# EAGLE design micro_solar (EAGLE 5.07)
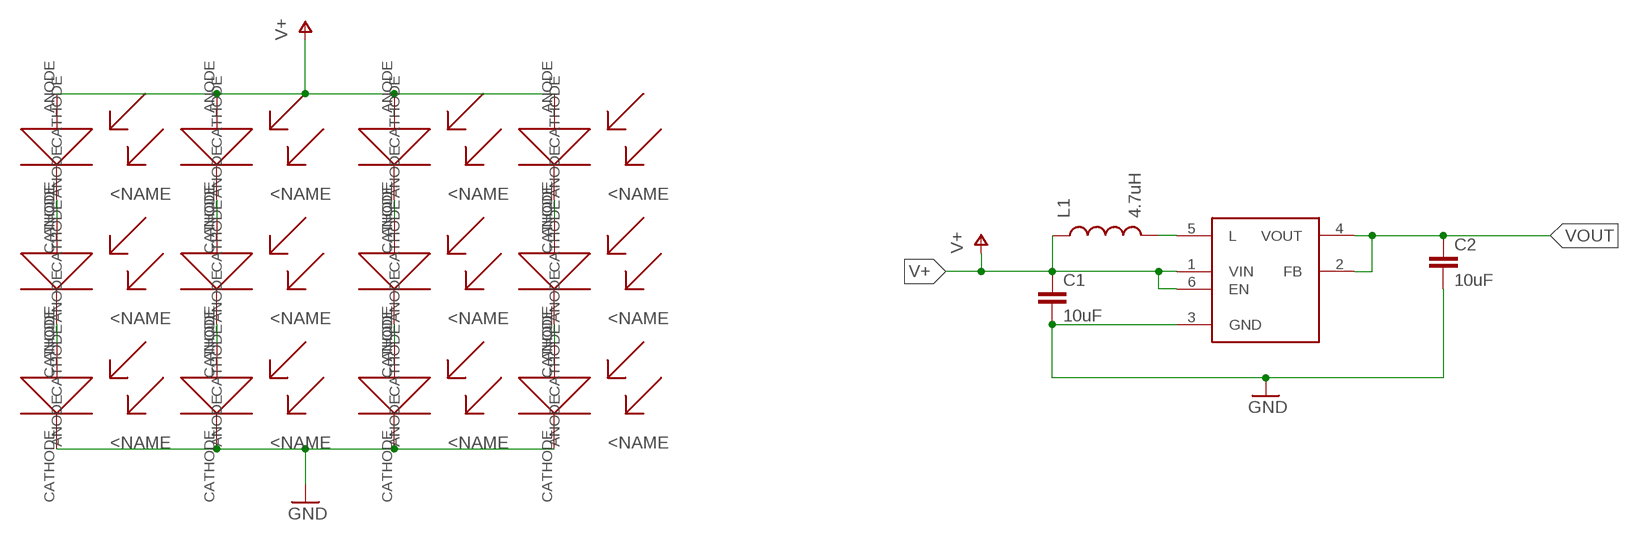
[diagram p0: schematic, sheet 1]

## Parts
C1  10uF  CAP0603-CAP  [0603-CAP]
C2  10uF  CAP0603-CAP  [0603-CAP]
L1  4.7uH  INDUCTOR0603  [0603]
U$1  TEMD5080  [SMD-PIN-DIODE-BIG]
U$2  TEMD5080  [SMD-PIN-DIODE-BIG]
U$3  TEMD5080  [SMD-PIN-DIODE-BIG]
U$4  TEMD5080  [SMD-PIN-DIODE-BIG]
U$5  TEMD5080  [SMD-PIN-DIODE-BIG]
U$6  TEMD5080  [SMD-PIN-DIODE-BIG]
U$7  TEMD5080  [SMD-PIN-DIODE-BIG]
U$8  TEMD5080  [SMD-PIN-DIODE-BIG]
U$9  TEMD5080  [SMD-PIN-DIODE-BIG]
U$10  TEMD5080  [SMD-PIN-DIODE-BIG]
U$11  TEMD5080  [SMD-PIN-DIODE-BIG]
U$12  TEMD5080  [SMD-PIN-DIODE-BIG]
U$13  TPS6122XDCK  [SC70-6L]

## Nets
GND: C1.2 C2.2 U$1.CATHODE U$2.CATHODE U$7.CATHODE U$8.CATHODE U$13.3(GND)
N$1: L1.2 U$13.5(L)
N$2: U$3.ANODE U$6.CATHODE
N$3: U$4.ANODE U$5.CATHODE
N$4: U$9.ANODE U$12.CATHODE
N$5: U$10.ANODE U$11.CATHODE
N$6: U$8.ANODE U$10.CATHODE
N$7: U$7.ANODE U$9.CATHODE
N$8: U$2.ANODE U$4.CATHODE
N$9: U$1.ANODE U$3.CATHODE
V+: C1.1 L1.1 U$5.ANODE U$6.ANODE U$11.ANODE U$12.ANODE U$13.1(VIN) U$13.6(EN)
VOUT: C2.1 U$13.2(FB) U$13.4(VOUT)

## Library data of the parts
C1 C2 = SparkFun:CAP: Capacitor Standard 0603 ceramic capacitor, and 0.1" leaded capacitor.
L1 = SparkFun:INDUCTOR: Inductors Basic Inductor/Choke - 0603 and 1206. Footprints are not proven and vary greatly between part numbers.
U$1-U$12 = MakerBot:TEMD5080
U$13 = MakerBot:TPS6122X

## Board
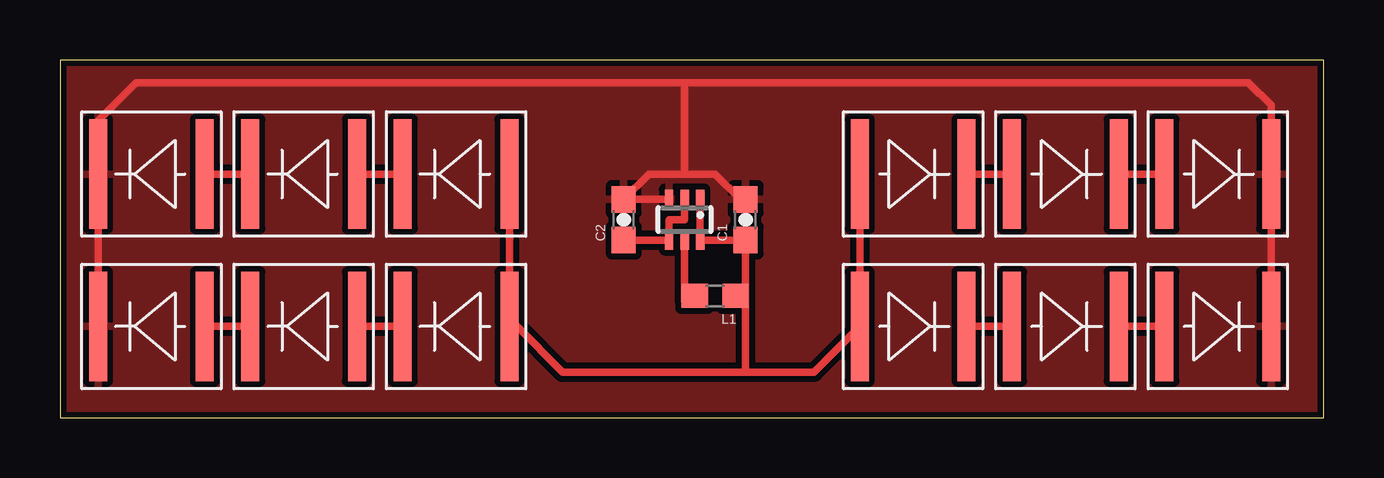
[diagram p1: board, top side]

Size 52.69 x 14.91 mm. Coordinates in mm from the lower left corner, seen from the top.
Outline: 0,0 52.69,0 52.69,14.91 0,14.91 0,0
Copper layers (1*16): Top 0.035mm / dielectric 1.5mm / Bottom 0.035mm
Design rules "SparkFun *": minimum track width 8mil, minimum drill 20mil, track to track 10mil, track to pad 10mil, pad to pad 10mil, via to via 10mil, smd to smd 10mil, copper to edge 10mil, drill to drill 8mil, minimum pad ring 12mil, minimum via ring 10mil, stop-mask expansion 4mil, vias tented up to drill 25mil, thermal gap 10mil

### Footprints (pad centres in the part's own frame; a part is rotated, then mirrored left to right if it is on the bottom)
0603-CAP = smd 1.1 x 1: 1 -0.85,0; 2 0.85,0
0603 = smd 1.1 x 1: 1 -0.85,0; 2 0.85,0
SMD-PIN-DIODE-BIG = smd 4.55 x 0.75: ANODE 0,2.225; CATHODE 0,-2.225
SC70-6L = smd 0.35 x 0.8: 1 -0.65,-0.85; 2 0,-0.85; 3 0.65,-0.85; 4 0.65,0.85; 5 0,0.85; 6 -0.65,0.85

### Placement (x,y rotation side)
C1  28.57,8.26 90 top
C2  23.5,8.26 90 top
L1  27.3,5.08 180 top
U$1  48.26,10.16 90 top
U$2  48.26,3.81 90 top
U$3  41.91,10.16 90 top
U$4  41.91,3.81 90 top
U$5  35.56,3.81 90 top
U$6  35.56,10.16 90 top
U$7  3.81,10.16 270 top
U$8  3.81,3.81 270 top
U$9  10.16,10.16 270 top
U$10  10.16,3.81 270 top
U$11  16.51,3.81 270 top
U$12  16.51,10.16 270 top
U$13  26.04,8.26 180 top

### Tracks (layer width: path | path; a pad name or v marks a point on that pad's centre or on a via)
GND
  Top 0.305: U$13.3 C2.2 24.55,10.16 26.04,10.16 | 28.84,9.37 C1.2 28.36,9.11 27.3,10.16 26.04,10.16 | U$2.CATHODE U$1.CATHODE 50.48,13.02 49.53,13.97 26.04,13.97 | U$8.CATHODE U$7.CATHODE 1.58,12.38 3.17,13.97 26.04,13.97 | 26.04,13.97 26.04,10.16
  pour Top: 0,14.61 52.7,14.61 52.7,0 0,0
N$1
  Top 0.305: U$13.5 26.04,4.87 L1.2
N$2
  Top 0.305: U$6.CATHODE U$3.ANODE
N$3
  Top 0.305: U$5.CATHODE U$4.ANODE
N$4
  Top 0.305: U$9.ANODE U$12.CATHODE
N$5
  Top 0.305: U$10.ANODE U$11.CATHODE
N$6
  Top 0.305: U$8.ANODE U$10.CATHODE
N$7
  Top 0.305: U$7.ANODE U$9.CATHODE
N$8
  Top 0.305: U$4.CATHODE U$2.ANODE
N$9
  Top 0.305: U$3.CATHODE U$1.ANODE
V+
  Top 0.305: 28.57,4.87 C1.1 U$13.6 U$13.1 | 28.57,4.87 L1.1 27.94,4.87 | U$6.ANODE U$5.ANODE 31.43,1.91 28.57,1.91 | U$12.ANODE U$11.ANODE 19.05,3.81 20.95,1.91 28.57,1.91 | 28.57,1.91 28.57,4.87
VOUT
  Top 0.305: 23.48,7.42 C2.1 U$13.4 25.39,8.24 25.4,8.26 26.04,8.26 U$13.2